# Altium schematic sheet Motor Drivers.SchDoc
size A; SheetNumber: 8; SheetTotal: 9
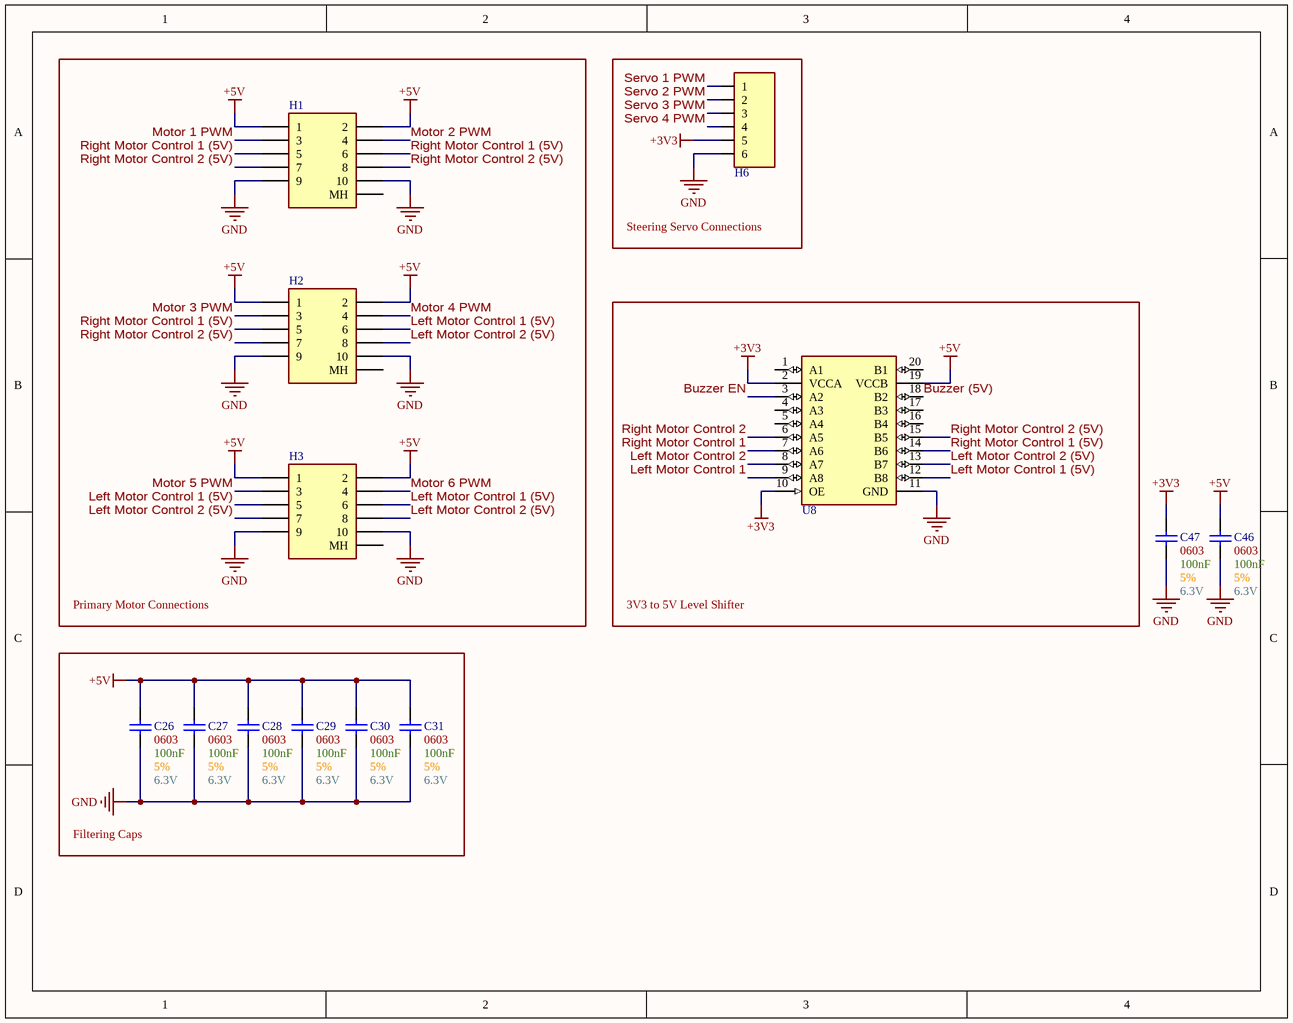
[diagram p0: Motor Drivers.SchDoc]

## Parts
C26  Size Package: 0603  Capacitance: 100nF  Voltage: 6.3V  Tolerance: 5%  [[Cap] SMD 0603]  (hidden comment: [Cap] SMD Nonpolarized)
C27  Size Package: 0603  Capacitance: 100nF  Voltage: 6.3V  Tolerance: 5%  [[Cap] SMD 0603]  (hidden comment: [Cap] SMD Nonpolarized)
C28  Size Package: 0603  Capacitance: 100nF  Voltage: 6.3V  Tolerance: 5%  [[Cap] SMD 0603]  (hidden comment: [Cap] SMD Nonpolarized)
C29  Size Package: 0603  Capacitance: 100nF  Voltage: 6.3V  Tolerance: 5%  [[Cap] SMD 0603]  (hidden comment: [Cap] SMD Nonpolarized)
C30  Size Package: 0603  Capacitance: 100nF  Voltage: 6.3V  Tolerance: 5%  [[Cap] SMD 0603]  (hidden comment: [Cap] SMD Nonpolarized)
C31  Size Package: 0603  Capacitance: 100nF  Voltage: 6.3V  Tolerance: 5%  [[Cap] SMD 0603]  (hidden comment: [Cap] SMD Nonpolarized)
C46  Size Package: 0603  Capacitance: 100nF  Voltage: 6.3V  Tolerance: 5%  [[Cap] SMD 0603]  (hidden comment: [Cap] SMD Nonpolarized)
C47  Size Package: 0603  Capacitance: 100nF  Voltage: 6.3V  Tolerance: 5%  [[Cap] SMD 0603]  (hidden comment: [Cap] SMD Nonpolarized)
H1  [Header] Shrouded 2x5 SMD  [[Header] Shrouded 2x5 SMD]  (value not drawn)
H2  [Header] Shrouded 2x5 SMD  [[Header] Shrouded 2x5 SMD]  (value not drawn)
H3  [Header] Shrouded 2x5 SMD  [[Header] Shrouded 2x5 SMD]  (value not drawn)
H6  [Header] Shrouded 1x6 Male  [[Header] Shrouded 1x6 Male]  (value not drawn)
U8  [IC] Level Shifter (2)  [[IC] Level Shifter (2)]  (value not drawn)

## Blocks framed on the sheet
Primary Motor Connections: H1-H3
Steering Servo Connections: H6
3V3 to 5V Level Shifter: U8
Filtering Caps: C26-C31

## Nets
+3V3: C47.2 H6.5 U8.2(VCCA) U8.10(OE)
+5V: C26.2 C27.2 C28.2 C29.2 C30.2 C31.2 C46.2 H1.1 H1.2 H2.1 H2.2 H3.1 H3.2 U8.19(VCCB)
GND: C26.1 C27.1 C28.1 C29.1 C30.1 C31.1 C46.1 C47.1 H1.9 H1.10 H2.9 H2.10 H3.9 H3.10 H6.6 U8.11(GND)
Buzzer (5V): U8.18(B2)
Buzzer EN: U8.3(A2)
Left Motor Control 1: U8.9(A8)
Left Motor Control 1 (5V): H2.6 H3.5 H3.6 U8.12(B8)
Left Motor Control 2: U8.8(A7)
Left Motor Control 2 (5V): H2.8 H3.7 H3.8 U8.13(B7)
Motor 1 PWM: H1.3
Motor 2 PWM: H1.4
Motor 3 PWM: H2.3
Motor 4 PWM: H2.4
Motor 5 PWM: H3.3
Motor 6 PWM: H3.4
Right Motor Control 1: U8.7(A6)
Right Motor Control 1 (5V): H1.5 H1.6 H2.5 U8.14(B6)
Right Motor Control 2: U8.6(A5)
Right Motor Control 2 (5V): H1.7 H1.8 H2.7 U8.15(B5)
Servo 1 PWM: H6.1
Servo 2 PWM: H6.2
Servo 3 PWM: H6.3
Servo 4 PWM: H6.4

Not connected (* = marked no-connect by the designer): H1 X(MH); H2 X(MH); H3 X(MH); U8 1(A1) 4(A3) 5(A4) 16(B4) 17(B3) 20(B1)

## Library data of the parts
H6 = [Header] Shrouded 1x6 Male: 0705430005 / Mates with 0050579406; Supplier 1: DigiKey; Supplier 2: DigiKey; Supplier Part Number 1: WM4804-ND; Supplier Part Number 2: WM2904-ND
U8 = [IC] Level Shifter (2): TXS0108EQPWRQ1; Supplier 1: DigiKey; Supplier Part Number 1: 296-42401-1-ND
C26-C31 C46 C47 = [Cap] SMD Nonpolarized: Supplier 1: DigiKey; Supplier Part Number 1: 311-1088-6-ND
H1-H3 = [Header] Shrouded 2x5 SMD: Supplier 1: DigiKey; Supplier Part Number 1: WM4227-ND